# Altium schematic sheet Mainboard_MCU_Breakout.SchDoc
size A4
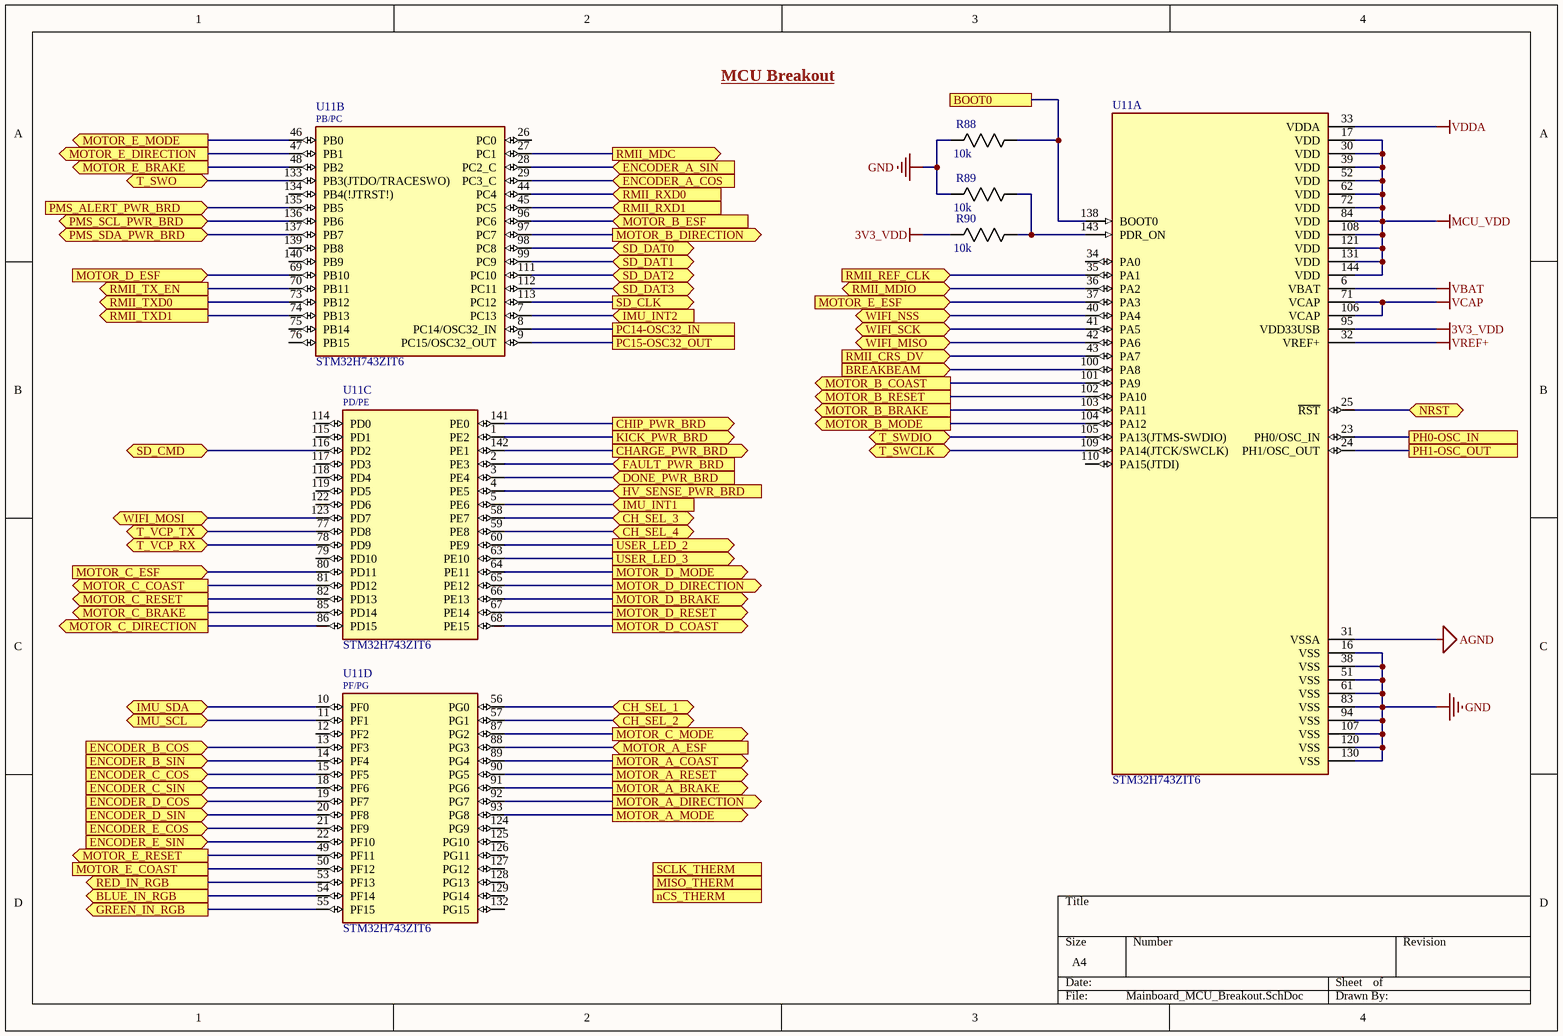
[diagram p0: Mainboard_MCU_Breakout.SchDoc]

## Parts
R88  10k  [0805]
R89  10k  [0805]
R90  10k  [0805]
U11  STM32H743ZIT6  [QFP50P2200X2200X160-144N]  (parts A,B,C,D of 4)

## Ports
BLUE_IN_RGB (out), BOOT0, BREAKBEAM (in), CH_SEL_1 (bidir), CH_SEL_2 (bidir), CH_SEL_3 (bidir), CH_SEL_4 (bidir), CHARGE_PWR_BRD (out), CHIP_PWR_BRD (out), DONE_PWR_BRD (in), ENCODER_A_COS (in), ENCODER_A_SIN (in), ENCODER_B_COS (in), ENCODER_B_SIN (in), ENCODER_C_COS (in), ENCODER_C_SIN (in), ENCODER_D_COS (in), ENCODER_D_SIN (in), ENCODER_E_COS (in), ENCODER_E_SIN (in), FAULT_PWR_BRD (in), GREEN_IN_RGB (out), HV_SENSE_PWR_BRD (in), IMU_INT1 (in), IMU_INT2 (in), IMU_SCL (bidir), IMU_SDA (bidir), KICK_PWR_BRD (out), MISO_THERM (in), MOTOR_A_BRAKE (out), MOTOR_A_COAST (out), MOTOR_A_DIRECTION (out), MOTOR_A_ESF (in), MOTOR_A_MODE (out), MOTOR_A_RESET (out), MOTOR_B_BRAKE (out), MOTOR_B_COAST (out), MOTOR_B_DIRECTION (out), MOTOR_B_ESF (in), MOTOR_B_MODE (out), MOTOR_B_RESET (out), MOTOR_C_BRAKE (out), MOTOR_C_COAST (out), MOTOR_C_DIRECTION (out), MOTOR_C_ESF (in), MOTOR_C_MODE (out), MOTOR_C_RESET (out), MOTOR_D_BRAKE (out), MOTOR_D_COAST (out), MOTOR_D_DIRECTION (out), MOTOR_D_ESF (in), MOTOR_D_MODE (out), MOTOR_D_RESET (out), MOTOR_E_BRAKE (out), MOTOR_E_COAST, MOTOR_E_DIRECTION (out), MOTOR_E_ESF (in), MOTOR_E_MODE (out), MOTOR_E_RESET (out), nCS_THERM (out), NRST (bidir), PC14-OSC32_IN, PC15-OSC32_OUT, PH0-OSC_IN, PH1-OSC_OUT, PMS_ALERT_PWR_BRD (in), PMS_SCL_PWR_BRD (bidir), PMS_SDA_PWR_BRD (bidir), RED_IN_RGB (out), RMII_CRS_DV (in), RMII_MDC (out), RMII_MDIO (bidir), RMII_REF_CLK (in), RMII_RXD0 (in), RMII_RXD1 (in), RMII_TX_EN (out), RMII_TXD0 (out), RMII_TXD1 (out), SCLK_THERM (out), SD_CLK (out), SD_CMD (bidir), SD_DAT0 (bidir), SD_DAT1 (bidir), SD_DAT2 (bidir), SD_DAT3 (bidir), T_SWCLK (bidir), T_SWDIO (bidir), T_SWO (bidir), T_VCP_RX (bidir), T_VCP_TX (bidir), USER_LED_2 (out), USER_LED_3 (out), WIFI_MISO (bidir), WIFI_MOSI (bidir), WIFI_NSS (bidir), WIFI_SCK (bidir)

## Nets
3V3_VDD: R90.2(R2) U11.95(VDD33USB)
AGND: U11.31(VSSA)
GND: R88.2(R2) R89.2(R2) U11.16(VSS) U11.38(VSS) U11.51(VSS) U11.61(VSS) U11.83(VSS) U11.94(VSS) U11.107(VSS) U11.120(VSS) U11.130(VSS)
MCU_VDD: U11.17(VDD) U11.30(VDD) U11.39(VDD) U11.52(VDD) U11.62(VDD) U11.72(VDD) U11.84(VDD) U11.108(VDD) U11.121(VDD) U11.131(VDD) U11.144(VDD)
VBAT: U11.6(VBAT)
VCAP: U11.71(VCAP) U11.106(VCAP)
VDDA: U11.33(VDDA)
VREF+: U11.32(VREF+)
BLUE_IN_RGB: U11.54(PF14) ; port BLUE_IN_RGB
BOOT0: R88.1(R1) U11.138(BOOT0) ; port BOOT0
BREAKBEAM: U11.100(PA8) ; port BREAKBEAM
CH_SEL_1: U11.56(PG0) ; port CH_SEL_1
CH_SEL_2: U11.57(PG1) ; port CH_SEL_2
CH_SEL_3: U11.58(PE7) ; port CH_SEL_3
CH_SEL_4: U11.59(PE8) ; port CH_SEL_4
CHARGE_PWR_BRD: U11.142(PE1) ; port CHARGE_PWR_BRD
CHIP_PWR_BRD: U11.141(PE0) ; port CHIP_PWR_BRD
DONE_PWR_BRD: U11.3(PE4) ; port DONE_PWR_BRD
ENCODER_A_COS: U11.29(PC3_C) ; port ENCODER_A_COS
ENCODER_A_SIN: U11.28(PC2_C) ; port ENCODER_A_SIN
ENCODER_B_COS: U11.13(PF3) ; port ENCODER_B_COS
ENCODER_B_SIN: U11.14(PF4) ; port ENCODER_B_SIN
ENCODER_C_COS: U11.15(PF5) ; port ENCODER_C_COS
ENCODER_C_SIN: U11.18(PF6) ; port ENCODER_C_SIN
ENCODER_D_COS: U11.19(PF7) ; port ENCODER_D_COS
ENCODER_D_SIN: U11.20(PF8) ; port ENCODER_D_SIN
ENCODER_E_COS: U11.21(PF9) ; port ENCODER_E_COS
ENCODER_E_SIN: U11.22(PF10) ; port ENCODER_E_SIN
FAULT_PWR_BRD: U11.2(PE3) ; port FAULT_PWR_BRD
GREEN_IN_RGB: U11.55(PF15) ; port GREEN_IN_RGB
HV_SENSE_PWR_BRD: U11.4(PE5) ; port HV_SENSE_PWR_BRD
IMU_INT1: U11.5(PE6) ; port IMU_INT1
IMU_INT2: U11.7(PC13) ; port IMU_INT2
IMU_SCL: U11.11(PF1) ; port IMU_SCL
IMU_SDA: U11.10(PF0) ; port IMU_SDA
KICK_PWR_BRD: U11.1(PE2) ; port KICK_PWR_BRD
MOTOR_A_BRAKE: U11.91(PG6) ; port MOTOR_A_BRAKE
MOTOR_A_COAST: U11.89(PG4) ; port MOTOR_A_COAST
MOTOR_A_DIRECTION: U11.92(PG7) ; port MOTOR_A_DIRECTION
MOTOR_A_ESF: U11.88(PG3) ; port MOTOR_A_ESF
MOTOR_A_MODE: U11.93(PG8) ; port MOTOR_A_MODE
MOTOR_A_RESET: U11.90(PG5) ; port MOTOR_A_RESET
MOTOR_B_BRAKE: U11.103(PA11) ; port MOTOR_B_BRAKE
MOTOR_B_COAST: U11.101(PA9) ; port MOTOR_B_COAST
MOTOR_B_DIRECTION: U11.97(PC7) ; port MOTOR_B_DIRECTION
MOTOR_B_ESF: U11.96(PC6) ; port MOTOR_B_ESF
MOTOR_B_MODE: U11.104(PA12) ; port MOTOR_B_MODE
MOTOR_B_RESET: U11.102(PA10) ; port MOTOR_B_RESET
MOTOR_C_BRAKE: U11.85(PD14) ; port MOTOR_C_BRAKE
MOTOR_C_COAST: U11.81(PD12) ; port MOTOR_C_COAST
MOTOR_C_DIRECTION: U11.86(PD15) ; port MOTOR_C_DIRECTION
MOTOR_C_ESF: U11.80(PD11) ; port MOTOR_C_ESF
MOTOR_C_MODE: U11.87(PG2) ; port MOTOR_C_MODE
MOTOR_C_RESET: U11.82(PD13) ; port MOTOR_C_RESET
MOTOR_D_BRAKE: U11.66(PE13) ; port MOTOR_D_BRAKE
MOTOR_D_COAST: U11.68(PE15) ; port MOTOR_D_COAST
MOTOR_D_DIRECTION: U11.65(PE12) ; port MOTOR_D_DIRECTION
MOTOR_D_ESF: U11.69(PB10) ; port MOTOR_D_ESF
MOTOR_D_MODE: U11.64(PE11) ; port MOTOR_D_MODE
MOTOR_D_RESET: U11.67(PE14) ; port MOTOR_D_RESET
MOTOR_E_BRAKE: U11.48(PB2) ; port MOTOR_E_BRAKE
MOTOR_E_COAST: U11.50(PF12) ; port MOTOR_E_COAST
MOTOR_E_DIRECTION: U11.47(PB1) ; port MOTOR_E_DIRECTION
MOTOR_E_ESF: U11.37(PA3) ; port MOTOR_E_ESF
MOTOR_E_MODE: U11.46(PB0) ; port MOTOR_E_MODE
MOTOR_E_RESET: U11.49(PF11) ; port MOTOR_E_RESET
NRST: U11.25(~{RST}) ; port NRST
PC14-OSC32_IN: U11.8(PC14/OSC32_IN) ; port PC14-OSC32_IN
PC15-OSC32_OUT: U11.9(PC15/OSC32_OUT) ; port PC15-OSC32_OUT
PH0-OSC_IN: U11.23(PH0/OSC_IN) ; port PH0-OSC_IN
PH1-OSC_OUT: U11.24(PH1/OSC_OUT) ; port PH1-OSC_OUT
PMS_ALERT_PWR_BRD: U11.135(PB5) ; port PMS_ALERT_PWR_BRD
PMS_SCL_PWR_BRD: U11.136(PB6) ; port PMS_SCL_PWR_BRD
PMS_SDA_PWR_BRD: U11.137(PB7) ; port PMS_SDA_PWR_BRD
RED_IN_RGB: U11.53(PF13) ; port RED_IN_RGB
RMII_CRS_DV: U11.43(PA7) ; port RMII_CRS_DV
RMII_MDC: U11.27(PC1) ; port RMII_MDC
RMII_MDIO: U11.36(PA2) ; port RMII_MDIO
RMII_REF_CLK: U11.35(PA1) ; port RMII_REF_CLK
RMII_RXD0: U11.44(PC4) ; port RMII_RXD0
RMII_RXD1: U11.45(PC5) ; port RMII_RXD1
RMII_TX_EN: U11.70(PB11) ; port RMII_TX_EN
RMII_TXD0: U11.73(PB12) ; port RMII_TXD0
RMII_TXD1: U11.74(PB13) ; port RMII_TXD1
SD_CLK: U11.113(PC12) ; port SD_CLK
SD_CMD: U11.116(PD2) ; port SD_CMD
SD_DAT0: U11.98(PC8) ; port SD_DAT0
SD_DAT1: U11.99(PC9) ; port SD_DAT1
SD_DAT2: U11.111(PC10) ; port SD_DAT2
SD_DAT3: U11.112(PC11) ; port SD_DAT3
T_SWCLK: U11.109(PA14(JTCK/SWCLK)) ; port T_SWCLK
T_SWDIO: U11.105(PA13(JTMS-SWDIO)) ; port T_SWDIO
T_SWO: U11.133(PB3(JTDO/TRACESWO)) ; port T_SWO
T_VCP_RX: U11.78(PD9) ; port T_VCP_RX
T_VCP_TX: U11.77(PD8) ; port T_VCP_TX
USER_LED_2: U11.60(PE9) ; port USER_LED_2
USER_LED_3: U11.63(PE10) ; port USER_LED_3
WIFI_MISO: U11.42(PA6) ; port WIFI_MISO
WIFI_MOSI: U11.123(PD7) ; port WIFI_MOSI
WIFI_NSS: U11.40(PA4) ; port WIFI_NSS
WIFI_SCK: U11.41(PA5) ; port WIFI_SCK
NetR89_1: R89.1(R1) R90.1(R1) U11.143(PDR_ON)

Not connected (* = marked no-connect by the designer): U11 12(PF2) 26(PC0) 34(PA0) 75(PB14) 76(PB15) 79(PD10) 110(PA15(JTDI)) 114(PD0) 115(PD1) 117(PD3) 118(PD4) 119(PD5) 122(PD6) 124(PG9) 125(PG10) 126(PG11) 127(PG12) 128(PG13) 129(PG14) 132(PG15) 134(PB4(!JTRST!)) 139(PB8) 140(PB9)

## Notes on the sheet
- MCU Breakout
- (in symbol STM32H743ZIT6, part B) PB/PC
- (in symbol STM32H743ZIT6, part C) PD/PE
- (in symbol STM32H743ZIT6, part D) PF/PG

## Library data of the parts
R88-R90 = RES 10k 1/8W - 1%: RES SMD 10K OHM 1% 1/8W 0805; Power (Watts): 0.125W; Package: 0805; Value: 10k; Tolerance: 1%
U11 = STM32H743ZIT6: ARM® Cortex®-M7 STM32H7 Microcontroller IC 32-Bit 480MHz 2MB (2M x 8) FLASH 144-LQFP (20x20); MF: STMicroelectronics; Package: LQFP-144 STMicroelectronics; MP: STM32H743ZIT6; ComponentLink1Description: SnapEDA; ComponentLink1URL: https://www.snapeda.com/parts/STM32H743ZIT6/STMicroelectronics/view-part/1041111/?ref=snap; ComponentLink2Description: DigiKey; ComponentLink2URL: https://www.digikey.ca/en/products/detail/stmicroelectronics/STM32H743ZIT6/7809238; ComponentLink3Description: Datasheet; ComponentLink3URL: https://www.st.com/resource/en/datasheet/stm32h743bi.pdf; DigiKey PN: 497-17721-ND